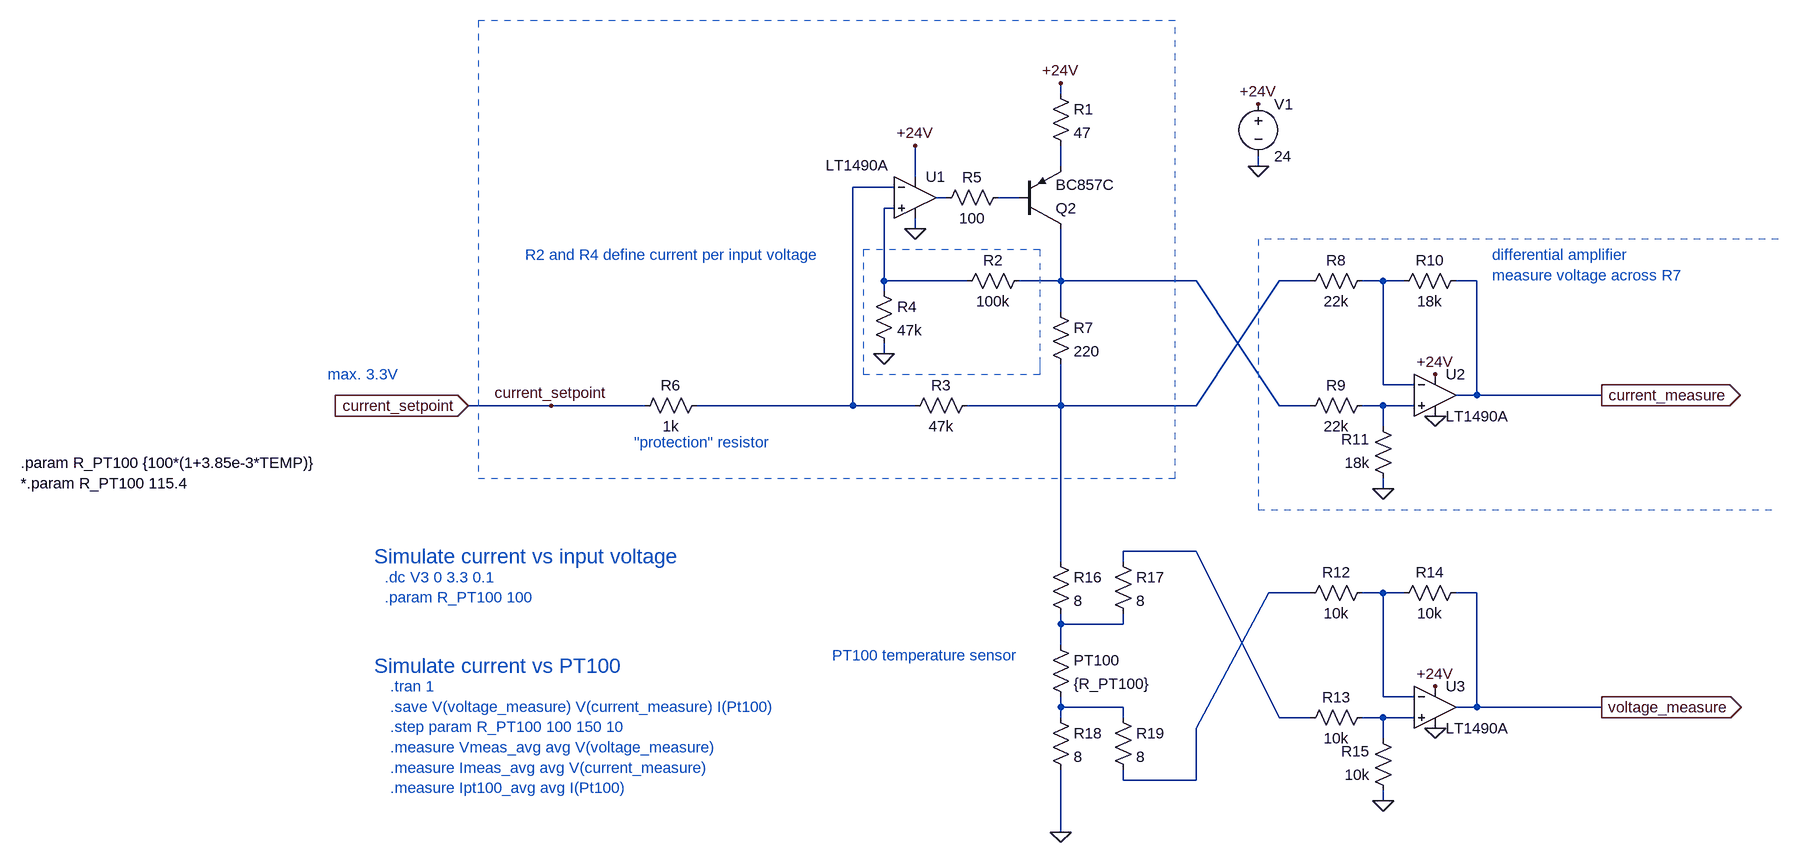
[diagram p0: schematic current_source.asc]
current_source.asc, the LTspice schematic file:
Version 4
SHEET 1 1380 1144
WIRE 272 -32 272 -48
WIRE 272 80 272 48
WIRE 576 80 576 64
WIRE 48 96 48 48
WIRE 16 112 -48 112
WIRE 96 128 80 128
WIRE 208 128 176 128
WIRE 16 144 0 144
WIRE 48 176 48 160
WIRE 0 256 0 144
WIRE 128 256 0 256
WIRE 272 256 272 176
WIRE 272 256 208 256
WIRE 480 256 272 256
WIRE 656 256 608 256
WIRE 768 256 736 256
WIRE 800 256 768 256
WIRE 912 256 880 256
WIRE 0 272 0 256
WIRE 272 304 272 256
WIRE 0 368 0 352
WIRE 768 416 768 256
WIRE 816 416 768 416
WIRE 912 432 912 256
WIRE 912 432 880 432
WIRE 1104 432 912 432
WIRE -512 448 -640 448
WIRE -368 448 -512 448
WIRE -48 448 -48 112
WIRE -48 448 -288 448
WIRE 48 448 -48 448
WIRE 272 448 272 384
WIRE 272 448 128 448
WIRE 480 448 608 256
WIRE 480 448 272 448
WIRE 608 448 480 256
WIRE 656 448 608 448
WIRE 768 448 736 448
WIRE 816 448 768 448
WIRE 768 480 768 448
WIRE 768 576 768 560
WIRE 480 672 368 672
WIRE 272 688 272 448
WIRE 368 688 368 672
WIRE 656 736 592 736
WIRE 768 736 736 736
WIRE 800 736 768 736
WIRE 912 736 880 736
WIRE 272 784 272 768
WIRE 368 784 368 768
WIRE 368 784 272 784
WIRE 272 816 272 784
WIRE 768 896 768 736
WIRE 816 896 768 896
WIRE 272 912 272 896
WIRE 368 912 272 912
WIRE 912 912 912 736
WIRE 912 912 880 912
WIRE 1104 912 912 912
WIRE 272 928 272 912
WIRE 368 928 368 912
WIRE 608 928 480 672
WIRE 656 928 608 928
WIRE 768 928 736 928
WIRE 816 928 768 928
WIRE 480 944 592 736
WIRE 768 960 768 928
WIRE 368 1024 368 1008
WIRE 480 1024 480 944
WIRE 480 1024 368 1024
WIRE 768 1056 768 1040
WIRE 272 1104 272 1008
FLAG 272 -48 +24V
FLAG 0 368 0
FLAG 272 1104 0
FLAG 576 80 0
FLAG 576 -16 +24V
FLAG 48 48 +24V
FLAG 48 176 0
FLAG 848 400 +24V
FLAG 848 464 0
FLAG 768 576 0
FLAG 1104 432 current_measure
IOPIN 1104 432 Out
FLAG 1104 912 voltage_measure
IOPIN 1104 912 Out
FLAG -512 448 current_setpoint
FLAG 848 880 +24V
FLAG 848 944 0
FLAG 768 1056 0
FLAG -640 448 current_setpoint
IOPIN -640 448 In
SYMBOL res 256 -48 R0
SYMATTR InstName R1
SYMATTR Value 47
SYMBOL res 224 240 R90
WINDOW 0 0 56 VBottom 2
WINDOW 3 32 56 VTop 2
SYMATTR InstName R2
SYMATTR Value 100k
SYMBOL res 144 432 R90
WINDOW 0 0 56 VBottom 2
WINDOW 3 32 56 VTop 2
SYMATTR InstName R3
SYMATTR Value 47k
SYMBOL res -16 256 R0
SYMATTR InstName R4
SYMATTR Value 47k
SYMBOL res 256 800 R0
SYMATTR InstName PT100
SYMATTR Value {R_PT100}
SYMBOL res -272 432 R90
WINDOW 0 0 56 VBottom 2
WINDOW 3 32 56 VTop 2
SYMATTR InstName R6
SYMATTR Value 1k
SYMBOL res 256 288 R0
SYMATTR InstName R7
SYMATTR Value 220
SYMBOL voltage 576 -32 R0
WINDOW 123 0 0 Left 2
WINDOW 39 0 0 Left 2
SYMATTR InstName V1
SYMATTR Value 24
SYMBOL pnp 208 176 M180
SYMATTR InstName Q2
SYMATTR Value BC857C
SYMBOL Opamps\\LT1490A 48 64 R0
WINDOW 3 -138 14 Left 2
SYMATTR InstName U1
SYMBOL res 192 112 R90
WINDOW 0 0 56 VBottom 2
WINDOW 3 32 56 VTop 2
SYMATTR InstName R5
SYMATTR Value 100
SYMBOL Opamps\\LT1490A 848 368 R0
SYMATTR InstName U2
SYMBOL res 752 240 R90
WINDOW 0 0 56 VBottom 2
WINDOW 3 32 56 VTop 2
SYMATTR InstName R8
SYMATTR Value 22k
SYMBOL res 752 432 R90
WINDOW 0 0 56 VBottom 2
WINDOW 3 32 56 VTop 2
SYMATTR InstName R9
SYMATTR Value 22k
SYMBOL res 896 240 R90
WINDOW 0 0 56 VBottom 2
WINDOW 3 32 56 VTop 2
SYMATTR InstName R10
SYMATTR Value 18k
SYMBOL res 784 576 R180
WINDOW 0 36 76 Left 2
WINDOW 3 36 40 Left 2
SYMATTR InstName R11
SYMATTR Value 18k
SYMBOL Opamps\\LT1490A 848 848 R0
SYMATTR InstName U3
SYMBOL res 752 720 R90
WINDOW 0 0 56 VBottom 2
WINDOW 3 32 56 VTop 2
SYMATTR InstName R12
SYMATTR Value 10k
SYMBOL res 752 912 R90
WINDOW 0 0 56 VBottom 2
WINDOW 3 32 56 VTop 2
SYMATTR InstName R13
SYMATTR Value 10k
SYMBOL res 896 720 R90
WINDOW 0 0 56 VBottom 2
WINDOW 3 32 56 VTop 2
SYMATTR InstName R14
SYMATTR Value 10k
SYMBOL res 784 1056 R180
WINDOW 0 36 76 Left 2
WINDOW 3 36 40 Left 2
SYMATTR InstName R15
SYMATTR Value 10k
SYMBOL res 256 672 R0
SYMATTR InstName R16
SYMATTR Value 8
SYMBOL res 352 672 R0
SYMATTR InstName R17
SYMATTR Value 8
SYMBOL res 256 912 R0
SYMATTR InstName R18
SYMATTR Value 8
SYMBOL res 352 912 R0
SYMATTR InstName R19
SYMATTR Value 8
TEXT -768 712 Left 2 ;.dc V3 0 3.3 0.1\n.param R_PT100 100
TEXT -552 216 Left 2 ;R2 and R4 define current per input voltage
TEXT -856 400 Left 2 ;max. 3.3V
TEXT -384 504 Left 2 ;"protection" resistor
TEXT 936 216 Left 2 ;differential amplifier\nmeasure voltage across R7
TEXT -80 832 Left 2 ;PT100 temperature sensor
TEXT -760 880 Left 2 ;.tran 1\n.save V(voltage_measure) V(current_measure) I(Pt100)\n.step param R_PT100 100 150 10\n.measure Vmeas_avg avg V(voltage_measure)\n.measure Imeas_avg avg V(current_measure)\n.measure Ipt100_avg avg I(Pt100)
TEXT -784 848 Left 3 ;Simulate current vs PT100
TEXT -784 680 Left 3 ;Simulate current vs input voltage
TEXT -1328 536 Left 2 !.param R_PT100 {100*(1+3.85e-3*TEMP)}\n*.param R_PT100 115.4
LINE Normal 576 192 576 608 2
LINE Normal 1376 192 576 192 2
LINE Normal 576 608 1376 608 2
LINE Normal 576 608 576 608 2
LINE Normal -32 240 -32 240 2
LINE Normal 240 208 -32 208 2
LINE Normal 240 384 240 208 2
LINE Normal 240 400 240 384 2
LINE Normal -32 400 240 400 2
LINE Normal -32 208 -32 400 2
LINE Normal -32 208 -32 208 2
RECTANGLE Normal -624 560 448 -144 2

The netlist it stands for:
* current_source.asc
R1 +24V N001 47
R2 N006 N005 100k
R3 N007 N002 47k
R4 N005 0 47k
R§PT100 N013 N014 {R_PT100}
R6 N002 current_setpoint 1k
R7 N006 N007 220
V1 +24V 0 24
Q2 N006 N004 N001 0 BC857C
XU1 N005 N002 +24V 0 N003 LT1490A  ; pins In+ In- V+ V- OUT
R5 N004 N003 100
XU2 N009 N008 +24V 0 current_measure LT1490A  ; pins In+ In- V+ V- OUT
R8 N008 N007 22k
R9 N009 N006 22k
R10 current_measure N008 18k
R11 0 N009 18k
XU3 N015 N012 +24V 0 voltage_measure LT1490A  ; pins In+ In- V+ V- OUT
R12 N012 N011 10k
R13 N015 N010 10k
R14 voltage_measure N012 10k
R15 0 N015 10k
R16 N007 N013 8
R17 N010 N013 8
R18 N014 0 8
R19 N014 N011 8
.model NPN NPN
.model PNP PNP
.lib standard.bjt
* .dc V3 0 3.3 0.1
* .param R_PT100 100
* R2 and R4 define current per input voltage
* max. 3.3V
* "protection" resistor
* differential amplifier
* measure voltage across R7
* PT100 temperature sensor
* .tran 1
* .save V(voltage_measure) V(current_measure) I(Pt100)
* .step param R_PT100 100 150 10
* .measure Vmeas_avg avg V(voltage_measure)
* .measure Imeas_avg avg V(current_measure)
* .measure Ipt100_avg avg I(Pt100)
* Simulate current vs PT100
* Simulate current vs input voltage
.param R_PT100 {100*(1+3.85e-3*TEMP)}
*.param R_PT100 115.4
.backanno
.end